# Altium schematic sheet FSR_Array_Sch.SchDoc
size A; SheetNumber: 1; SheetTotal: 1; SPICEModelCacheIHQLXJLT: <root> / <DocumentId>IHQLXJLT</DocumentId> / </root>
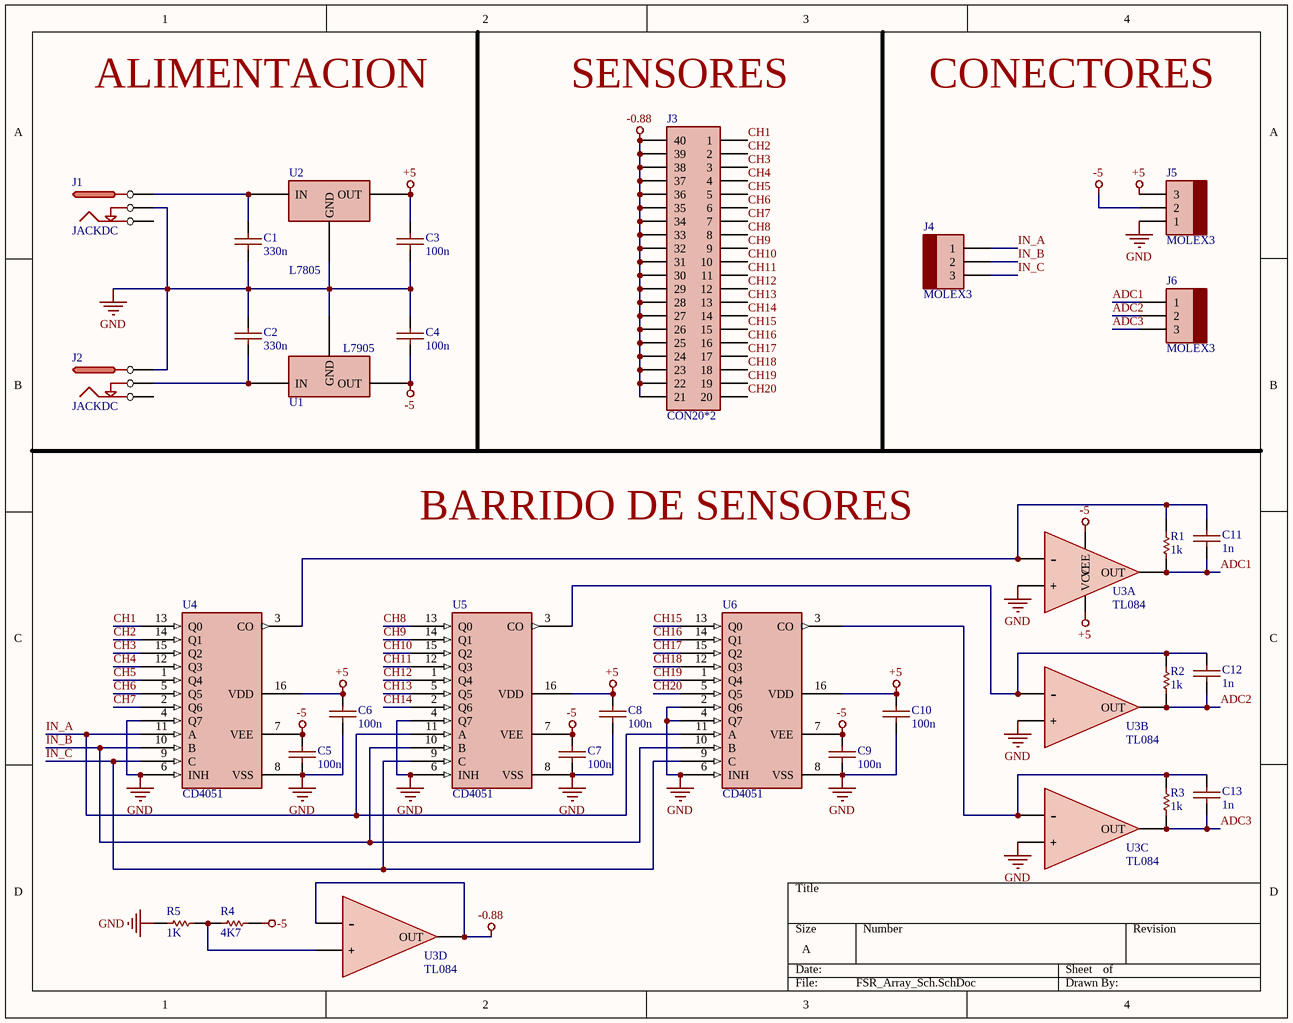
[diagram p0: FSR_Array_Sch.SchDoc]

## Parts
C1  330n  [0805]
C2  330n  [0805]
C3  100n  [0805]
C4  100n  [0805]
C5  100n  [0805]
C6  100n  [0805]
C7  100n  [0805]
C8  100n  [0805]
C9  100n  [0805]
C10  100n  [0805]
C11  1n  [0805]
C12  1n  [0805]
C13  1n  [0805]
J1  JACKDC  [JACKDC]
J2  JACKDC  [JACKDC]
J3  CON20*2  [SIP20*2]
J4  MOLEX3  [MOLEX3]
J5  MOLEX3  [MOLEX3]
J6  MOLEX3  [MOLEX3]
R1  1k  [0805]
R2  1k  [0805]
R3  1k  [0805]
R4  4K7  [0805]
R5  1K  [0805]
U1  L7905  [TO-220 V]
U2  L7805  [TO-220 V]
U3  TL084  [SOIC-14]  (parts A,B,C,D of 4)
U4  CD4051  [CD4051]
U5  CD4051  [CD4051]
U6  CD4051  [CD4051]

## Nets
+5: C3.1 C6.1 C8.1 C10.1 J5.3 U2.3(OUT) U3.4(VCC) U4.16(VDD) U5.16(VDD) U6.16(VDD)
-0.88: J3.21 J3.22 J3.23 J3.24 J3.25 J3.26 J3.27 J3.28 J3.29 J3.30 J3.31 J3.32 J3.33 J3.34 J3.35 J3.36 J3.37 J3.38 J3.39 J3.40 U3.13(-) U3.14(OUT)
-5: C4.2 C5.1 C7.1 C9.1 J5.2 R4.1 U1.3(OUT) U3.11(VEE) U4.7(VEE) U5.7(VEE) U6.7(VEE)
GND: C1.2 C2.1 C3.2 C4.1 C5.2 C6.2 C7.2 C8.2 C9.2 C10.2 J1.2 J2.1 J5.1 R5.1 U1.1(GND) U2.2(GND) U3.3(+) U3.5(+) U3.10(+) U4.4(Q7) U4.6(INH) U4.8(VSS) U5.4(Q7) U5.6(INH) U5.8(VSS) U6.2(Q6) U6.4(Q7) U6.6(INH) U6.8(VSS)
ADC1: C11.2 J6.1 R1.1 U3.1(OUT)
ADC2: C12.2 J6.2 R2.1 U3.7(OUT)
ADC3: C13.2 J6.3 R3.1 U3.8(OUT)
CH1: J3.1 U4.13(Q0)
CH2: J3.2 U4.14(Q1)
CH3: J3.3 U4.15(Q2)
CH4: J3.4 U4.12(Q3)
CH5: J3.5 U4.1(Q4)
CH6: J3.6 U4.5(Q5)
CH7: J3.7 U4.2(Q6)
CH8: J3.8 U5.13(Q0)
CH9: J3.9 U5.14(Q1)
CH10: J3.10 U5.15(Q2)
CH11: J3.11 U5.12(Q3)
CH12: J3.12 U5.1(Q4)
CH13: J3.13 U5.5(Q5)
CH14: J3.14 U5.2(Q6)
CH15: J3.15 U6.13(Q0)
CH16: J3.16 U6.14(Q1)
CH17: J3.17 U6.15(Q2)
CH18: J3.18 U6.12(Q3)
CH19: J3.19 U6.1(Q4)
CH20: J3.20 U6.5(Q5)
IN_A: J4.1 U4.11(A) U5.11(A) U6.11(A)
IN_B: J4.2 U4.10(B) U5.10(B) U6.10(B)
IN_C: J4.3 U4.9(C) U5.9(C) U6.9(C)
NetC1_1: C1.1 J1.1 U2.1(IN)
NetC2_2: C2.2 J2.2 U1.2(IN)
NetC11_1: C11.1 R1.2 U3.2(-) U4.3(CO)
NetC12_1: C12.1 R2.2 U3.6(-) U5.3(CO)
NetC13_1: C13.1 R3.2 U3.9(-) U6.3(CO)
NetR4_2: R4.2 R5.2 U3.12(+)

Not connected (* = marked no-connect by the designer): J1 3; J2 3

## Notes on the sheet
- ALIMENTACION
- (near J3) SENSORES
- CONECTORES
- BARRIDO DE SENSORES

## Library data of the parts
C1-C13 = CAP
R1-R5 = RES
U1 = LM7905